# EAGLE design LoRa ST Sensor Node v1.0 (EAGLE 7.5.0)
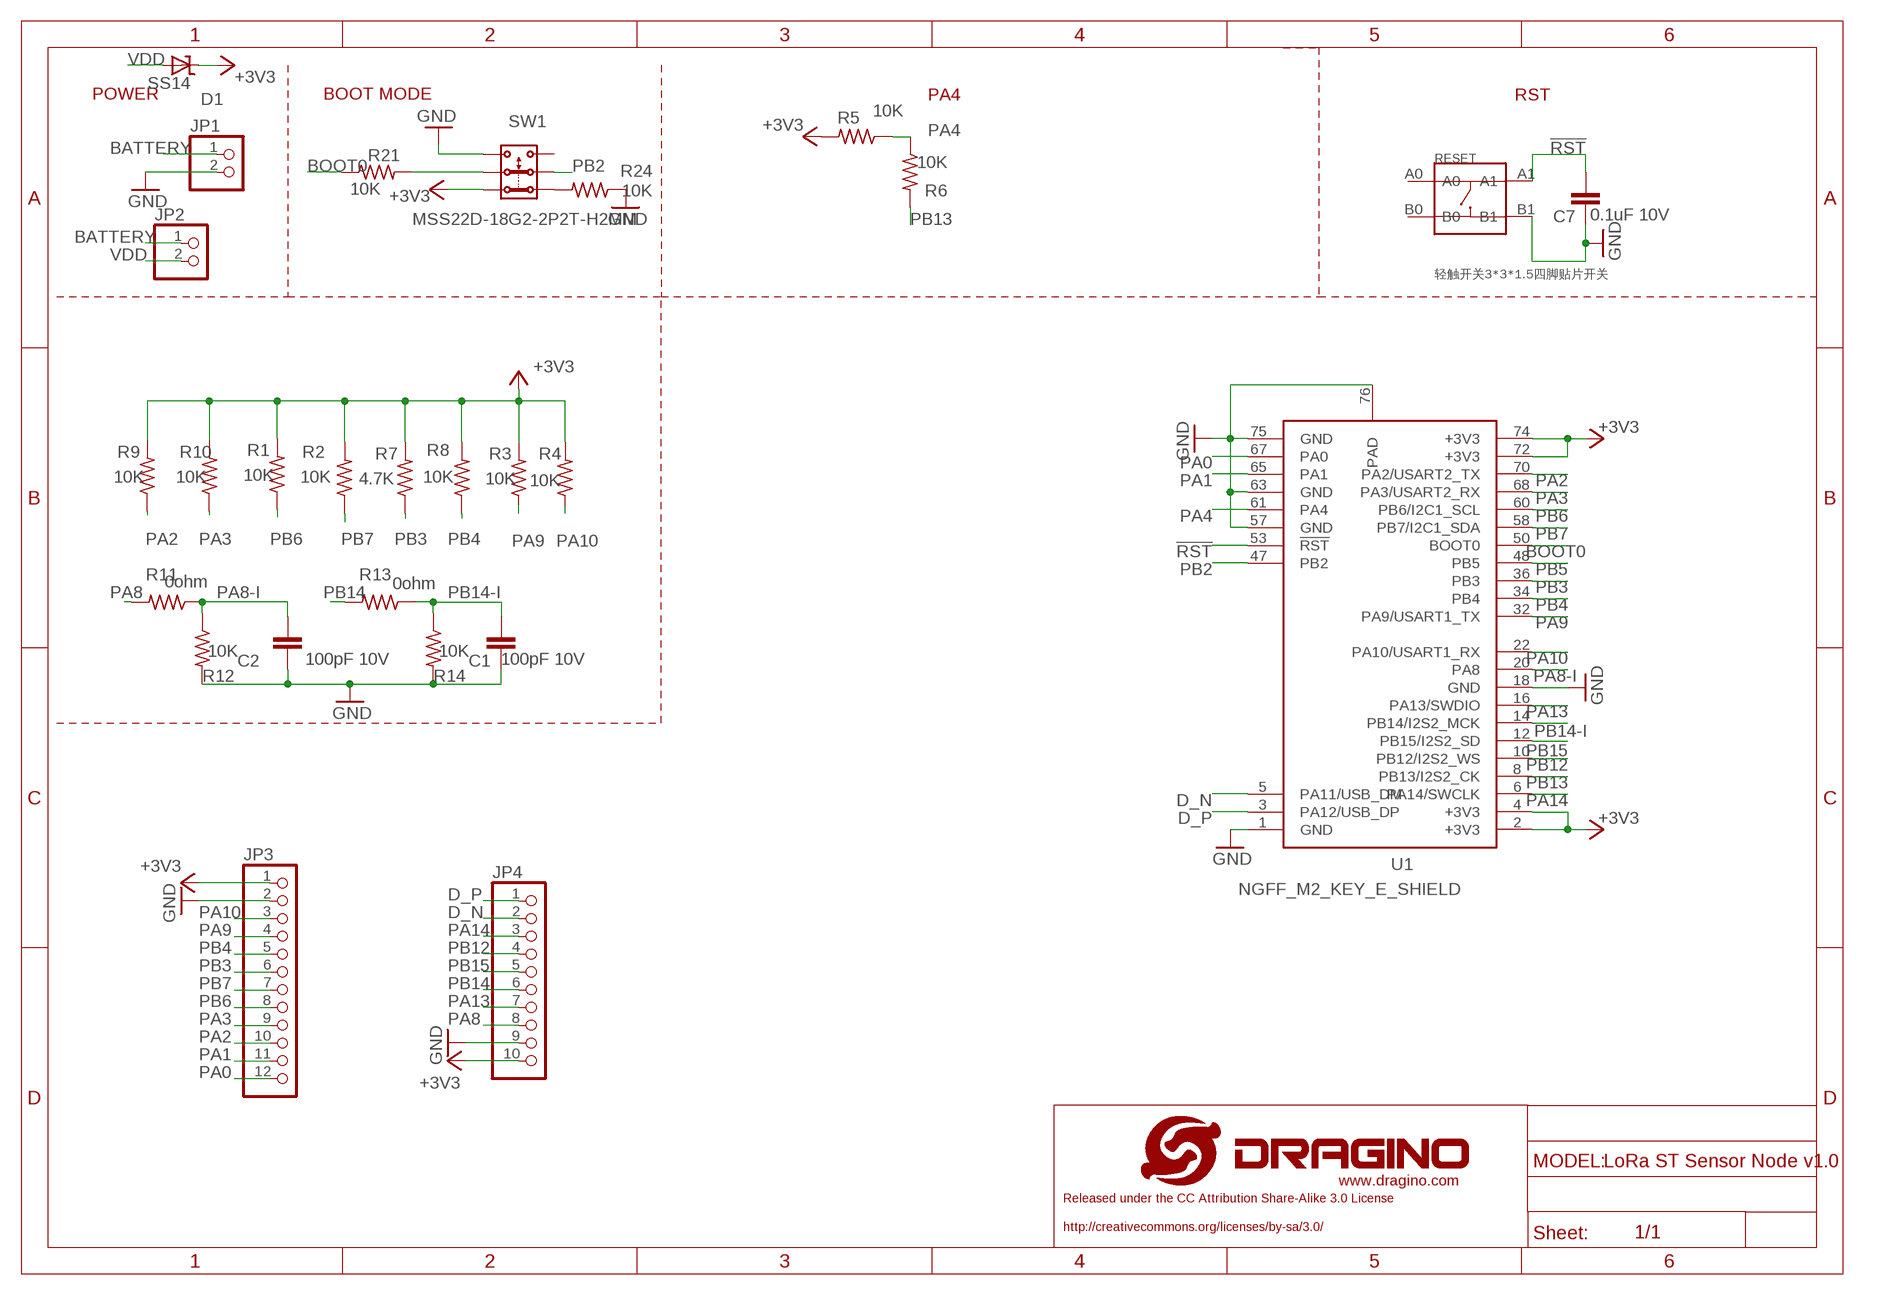
[diagram p0: schematic, sheet 1]

## Parts
C1  100pF 10V  C-EUC0603  [C0603]
C2  100pF 10V  C-EUC0603  [C0603]
C7  0.1uF 10V  C-EUC0402  [C0402]
D1  SS14  SCHOTTKYSMBG  [DO214AC]
JP1  PINHD-1X2POWER  [1X02-SMD]
JP2  PINHD-1X2  [1X02]
JP3  PINHD-1X12""  [1X12-DIP]
JP4  PINHD-1X10""  [1X10-DIP]
R1  10K  R-US_R0402  [R0402]
R2  10K  R-US_R0402  [R0402]
R3  10K  R-US_R0402  [R0402]
R4  10K  R-US_R0402  [R0402]
R5  10K  R-US_R0402  [R0402]
R6  10K  R-US_R0402  [R0402]
R7  4.7K  R-US_R0402  [R0402]
R8  10K  R-US_R0402  [R0402]
R9  10K  R-US_R0402  [R0402]
R10  10K  R-US_R0402  [R0402]
R11  0ohm  R-US_R0603  [R0603]
R12  10K  R-US_R0603  [R0603]
R13  0ohm  R-US_R0603  [R0603]
R14  10K  R-US_R0603  [R0603]
R21  10K  R-US_R0402  [R0402]
R24  10K  R-US_R0402  [R0402]
RESET  轻触开关3*3*1.5四脚贴片开关  BUTTON-4P-3.3X3.3  [SW4-SMD-3.35X3.35X1.5MM]
SW1  MSS22D-18G2-2P2T-H2MM  [MSS22D-18G2-2P2T-H2MM-DIL]
U1  NGFF_M2_KEY_E_SHIELD  [NGFF_M2_KEY_E_SHIELD]

## Nets
!RST: C7.2 RESET.A1 U1.53(!RST)
+3V3: D1.C JP3.1 JP4.10 R1.2 R2.2 R3.2 R4.2 R5.2 R7.2 R8.2 R9.2 R10.2 SW1.3 U1.2(+3V3) U1.4(+3V3) U1.72(+3V3) U1.74(+3V3)
BATTERY: JP1.1 JP2.1
BOOT0: R21.1 U1.50(BOOT0)
D_N: JP4.2 U1.5(PA11/USB_DM)
D_P: JP4.1 U1.3(PA12/USB_DP)
GND: C1.1 C2.1 C7.1 JP1.2 JP3.2 JP4.9 R12.2 R14.2 R24.1 RESET.B1 SW1.1 U1.1(GND) U1.18(GND) U1.57(GND) U1.63(GND) U1.75(GND) U1.76(PAD)
N$4: R24.2 SW1.4
N$22: R21.2 SW1.2
PA0: JP3.12 U1.67(PA0)
PA1: JP3.11 U1.65(PA1)
PA2: JP3.10 R9.1 U1.70(PA2/USART2_TX)
PA3: JP3.9 R10.1 U1.68(PA3/USART2_RX)
PA4: R5.1 R6.1 U1.61(PA4)
PA8: JP4.8 R11.2
PA8-I: C2.2 R11.1 R12.1 U1.20(PA8)
PA9: JP3.4 R3.1 U1.32(PA9/USART1_TX)
PA10: JP3.3 R4.1 U1.22(PA10/USART1_RX)
PA13: JP4.7 U1.16(PA13/SWDIO)
PA14: JP4.3 U1.6(PA14/SWCLK)
PB2: SW1.5 U1.47(PB2)
PB3: JP3.6 R7.1 U1.36(PB3)
PB4: JP3.5 R8.1 U1.34(PB4)
PB5: U1.48(PB5)
PB6: JP3.8 R1.1 U1.60(PB6/I2C1_SCL)
PB7: JP3.7 R2.1 U1.58(PB7/I2C1_SDA)
PB12: JP4.4 U1.10(PB12/I2S2_WS)
PB13: R6.2 U1.8(PB13/I2S2_CK)
PB14: JP4.6 R13.2
PB14-I: C1.2 R13.1 R14.1 U1.14(PB14/I2S2_MCK)
PB15: JP4.5 U1.12(PB15/I2S2_SD)
VDD: D1.A JP2.2
Unconnected: RESET.A0 RESET.B0 SW1.6

## Notes on the sheet
- PA4 | RST
- POWER | BOOT MODE

## Library data of the parts
C1 C2 C7 = dragino:C-EU: CAPACITOR, European symbol
D1 = dragino:SCHOTTKY: Suppressor diode; OC_FARNELL: unknown
JP1 JP2 = pinhead:PINHD-1X2: PIN HEADER
JP3 = pinhead:PINHD-1X12: PIN HEADER
JP4 = pinhead:PINHD-1X10: PIN HEADER
R1-R14 R21 R24 = dragino:R-US_: RESISTOR, American symbol
RESET = dragino:BUTTON-4P: SW4-6.0X6.0X5.0MM:311020024;SW4-8.0X8.0X9.0MM:311020028;SW4-SMD-6.0X6.0X5.0MM:311020004;SW4-SMD-3.35X3.35X1.5MM:311020030;SW4-SMD-5.2X5.2X2.5MM:311020046
SW1 = dragino:MSS22D-18G2-2P2T-H2MM
U1 = dragino:NGFF_M2_KEY_E_SHIELD

## Net classes
0 default: width 0.203 mm, clearance 0.203 mm
1 vcc: width 0.254 mm

## Board
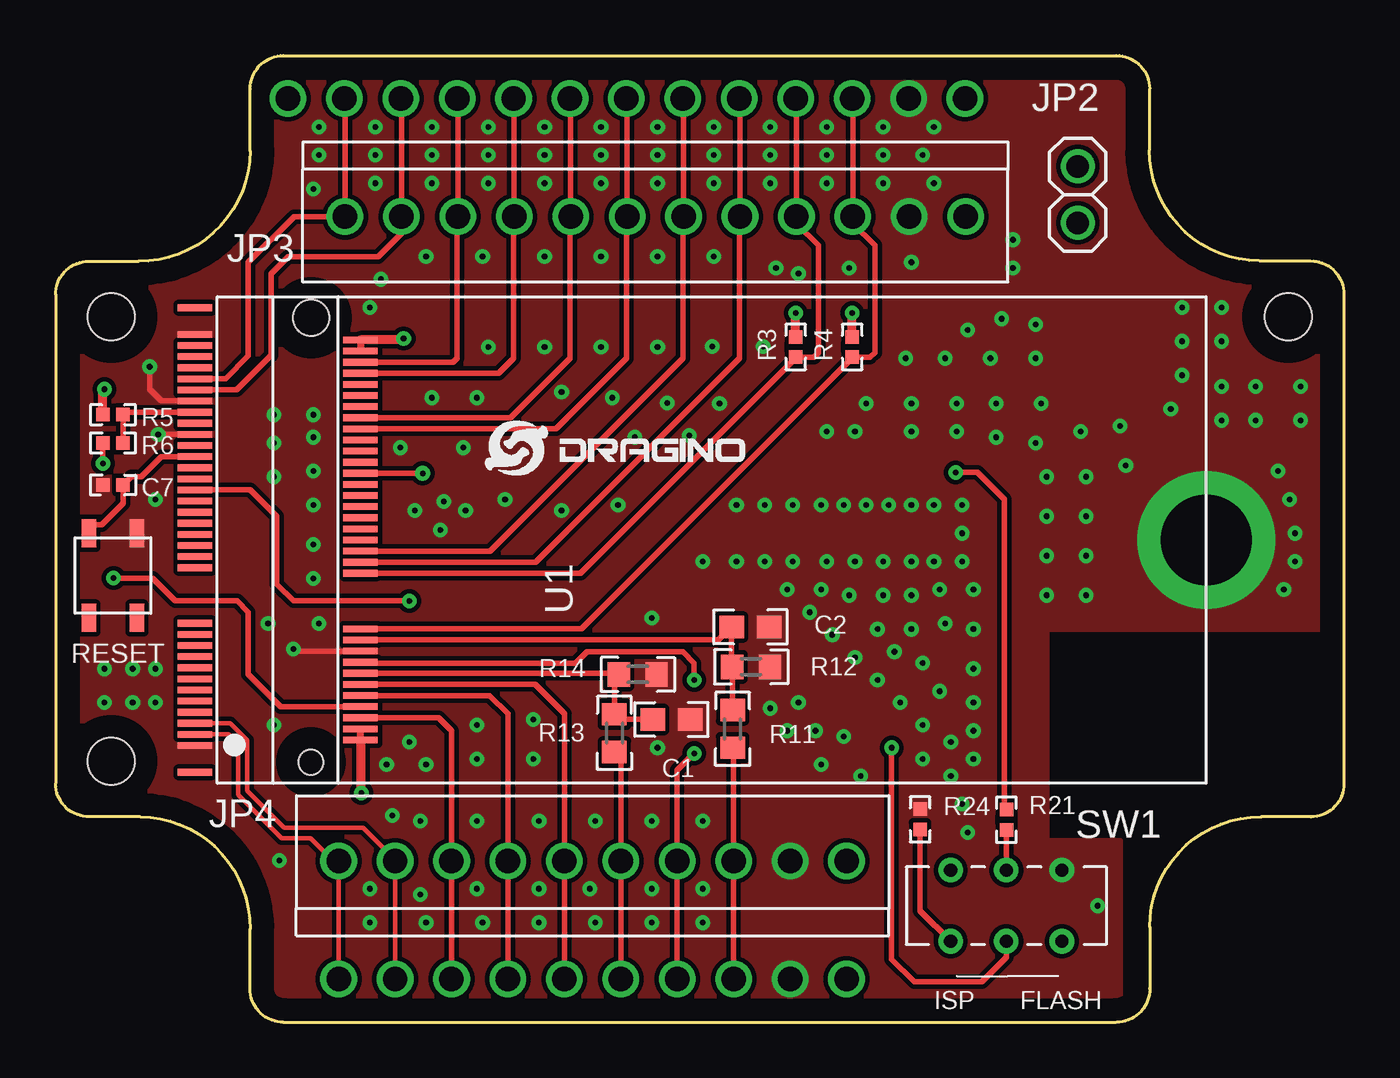
[diagram p1: board, top side]
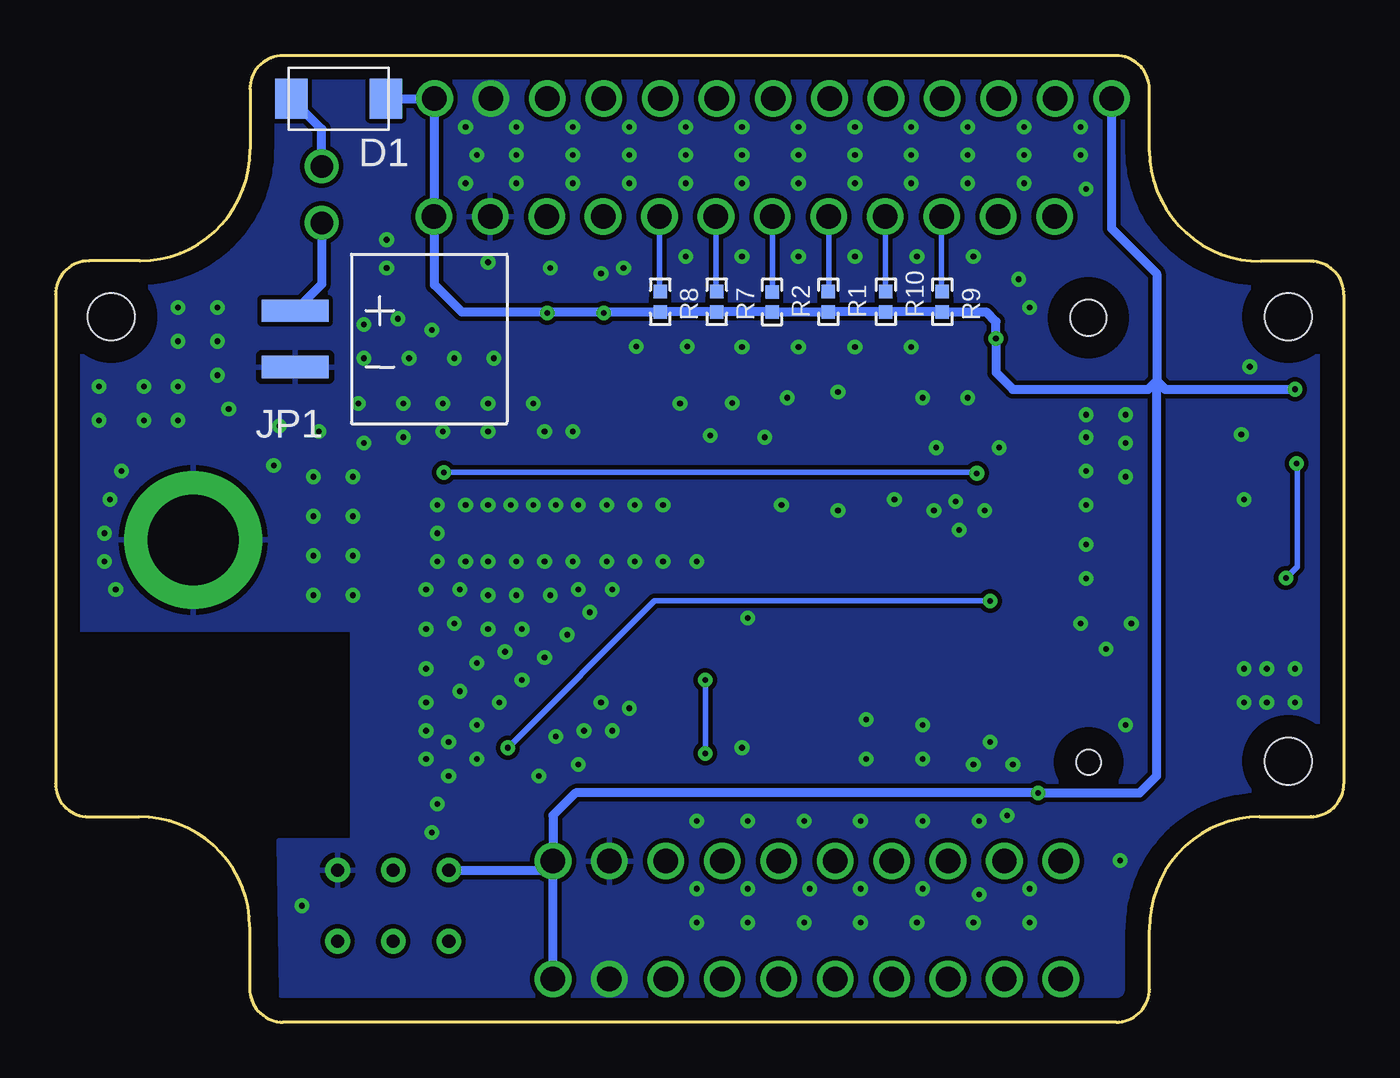
[diagram p2: board, bottom side, seen from below]

Size 58 x 43.5 mm. Coordinates in mm from the lower left corner, seen from the top.
Copper layers (1*16): Top 0.035mm / dielectric 1.5mm / Bottom 0.035mm
Design rules "default *": minimum track width 6mil, minimum drill 10mil, track to track 6mil, track to pad 10mil, pad to pad 6mil, via to via 6mil, smd to smd 6mil, copper to edge 40mil, drill to drill 8mil, minimum pad ring 10mil, minimum via ring 8mil, stop-mask expansion 4mil, vias tented up to drill 30mil, thermal gap 10mil
Holes 2.1 mm at 55.5,31.75 2.5,31.75 2.5,11.75

### Footprints (pad centres in the part's own frame; a part is rotated, then mirrored left to right if it is on the bottom)
C0603 = smd 1.1 x 1: 1 -0.85,0; 2 0.85,0
C0402 = smd 0.61 x 0.61: 1 -0.457,0; 2 0.457,0
DO214AC = smd 1.45 x 1.8: A 2.13,0; C -2.13,0
1X02-SMD = smd 3 x 1: 1 0,1.27; 2 0,-1.27
1X02 = drill 1.016: 1 -1.27,0; 2 1.27,0
1X12-DIP = drill 1.1: 1 -13.97,0; 2 -11.43,0; 3 -8.89,0; 4 -6.35,0; 5 -3.81,0; 6 -1.27,0; 7 1.27,0; 8 3.81,0; 9 6.35,0; 10 8.89,0; 11 11.43,0; 12 13.97,0
1X10-DIP = drill 1.1: 1 -11.43,0; 2 -8.89,0; 3 -6.35,0; 4 -3.81,0; 5 -1.27,0; 6 1.27,0; 7 3.81,0; 8 6.35,0; 9 8.89,0; 10 11.43,0
R0402 = smd 0.61 x 0.61: 1 -0.457,0; 2 0.457,0
R0603 = smd 1 x 1.1: 1 -0.85,0; 2 0.85,0
SW4-SMD-3.35X3.35X1.5MM = smd 1.27 x 0.635: A0 -1.905,1.079; A1 1.905,1.079; B0 -1.905,-1.079; B1 1.905,-1.079
MSS22D-18G2-2P2T-H2MM-DIL = drill 0.6: 1 -2.5,-1.6; 2 0,-1.6; 3 2.5,-1.6; 4 2.5,1.6; 5 0,1.6; 6 -2.5,1.6
NGFF_M2_KEY_E_SHIELD = smd 0.3 x 1.55: 1 1.7,-0.775; 2 1.95,-8.225; 3 2.2,-0.775; 4 2.45,-8.225; 5 2.7,-0.775; 6 2.95,-8.225; 7 3.2,-0.775; 8 3.45,-8.225; 9 3.7,-0.775; 10 3.95,-8.225; 11 4.2,-0.775; 12 4.45,-8.225; 13 4.7,-0.775; 14 4.95,-8.225; 15 5.2,-0.775; 16 5.45,-8.225; 17 5.7,-0.775; 18 5.95,-8.225; 19 6.2,-0.775; 20 6.45,-8.225; 21 6.7,-0.775; 22 6.95,-8.225; 23 7.2,-0.775; 32 9.45,-8.225; 33 9.7,-0.775; 34 9.95,-8.225; 35 10.2,-0.775; 36 10.45,-8.225; 37 10.7,-0.775; 38 10.95,-8.225; 39 11.2,-0.775; 40 11.45,-8.225; 41 11.7,-0.775; 42 11.95,-8.225; 43 12.2,-0.775; 44 12.45,-8.225; 45 12.7,-0.775; 46 12.95,-8.225; 47 13.2,-0.775; 48 13.45,-8.225; 49 13.7,-0.775; 50 13.95,-8.225; 51 14.2,-0.775; 52 14.45,-8.225; 53 14.7,-0.775; 54 14.95,-8.225; 55 15.2,-0.775; 56 15.45,-8.225; 57 15.7,-0.775; 58 15.95,-8.225; 59 16.2,-0.775; 60 16.45,-8.225; 61 16.7,-0.775; 62 16.95,-8.225; 63 17.2,-0.775; 64 17.45,-8.225; 65 17.7,-0.775; 66 17.95,-8.225; 67 18.2,-0.775; 68 18.45,-8.225; 69 18.7,-0.775; 70 18.95,-8.225; 71 19.2,-0.775; 72 19.45,-8.225; 73 19.7,-0.775; 74 19.95,-8.225; 75 20.2,-0.775; X 0.5,-0.775; Y 21.4,-0.775 | drill 4.09 pad 6.2: 76 10.95,-46.3 | hole 1.6: 20.95,-6 | hole 1.1: 0.95,-6

### Placement (x,y rotation side)
C1  27.73,13.62 180 top
C2  31.29,17.79 180 top
C7  2.59,24.17 0 top
D1  45.26,41.56 180 bottom
JP1  47.22,30.75 0 bottom
JP2  46.02,37.24 90 top
JP3  27,36.25 180 top
JP4  24.18,7.25 0 top
R1  23.21,32.42 270 bottom
R2  25.75,32.41 270 bottom
R3  33.32,30.39 90 top
R4  35.86,30.39 90 top
R5  2.59,27.34 180 top
R6  2.59,26.07 180 top
R7  28.24,32.42 270 bottom
R8  30.78,32.42 270 bottom
R9  18.08,32.42 270 bottom
R10  20.62,32.42 270 bottom
R11  30.48,13.2 270 top
R12  31.31,15.99 0 top
R13  25.16,13.01 270 top
R14  26.21,15.65 0 top
R21  42.81,9.11 270 top
R24  38.92,9.13 270 top
RESET  2.59,20.1 90 top
SW1  42.8,5.24 180 top
U1  5.5,10.75 90 top
U$1  [LORA_ST_SENSOR_NODE]  29,21.75 0 top
U$2  LOGO-NEW  [LOGO-SILK-NEW]  19.33,24.61 0 top

### Tracks (layer width: path | path; a pad name or v marks a point on that pad's centre or on a via)
!RST
  Top 0.254: RESET.A1 1.51,22.45 1.57,22.39 2.08,22.39 3.04,23.35 C7.2 3.41,24.54 3.86,24.54 4.76,25.45 U1.53
+3V3  (via drill 0.25, 1.1)
  Top 0.305: U1.2 U1.4 | U1.74 U1.72
  Top 0.406: v15.67,30.77 15.6,30.7 U1.74 | R5.2 2.13,28.41 arc-90 v2.21,28.48 | v13.76,10.32 13.76,12.66 U1.2 | R3.2 v33.32,31.91 | R4.2 v35.86,31.91
  Bottom 0.406: 8.43,28.86 8.43,11.08 9.19,10.32 v13.76,10.32 34.59,10.32 35.61,9.3 JP4.10 | 8.43,28.86 8.05,28.48 v2.21,28.48 | 8.43,28.86 8.81,28.48 14.91,28.48 15.67,29.24 v15.67,30.77 15.67,31.53 16.1,31.96 R9.2 R10.2 R1.2 R2.2 25.75,31.96 R7.2 R8.2 33.32,31.96 | SW1.3 36.02,6.84 JP4.10 | v35.61,1.94 JP4.10 | v10.46,41.56 10.46,35.72 8.43,33.69 8.43,28.86 | 35.81,31.96 39.72,31.96 40.94,33.18 40.94,36.22 JP3.1 40.94,36.28 v40.94,41.56 D1.C | v35.86,31.91 35.81,31.96 | 35.81,31.96 33.32,31.96 | v33.32,31.91 33.32,31.96
BATTERY
  Bottom 0.406: JP2.1 46.02,33.22 JP1.1
BOOT0  (via drill 0.25)
  Top 0.254: U1.50 16.2,24.7 v16.53,24.7 | R21.1 42.72,9.66 42.72,23.53 41.51,24.74 v40.52,24.74
  Bottom 0.254: v16.53,24.7 16.57,24.74 v40.52,24.74
D_N  (via drill 1.1)
  Top 0.203: U1.5 7.87,13.45 8.63,12.69 8.63,10.4 10.29,8.74 13.85,8.74 15.29,7.3 JP4.2 v15.29,1.94
D_P  (via drill 1.1)
  Top 0.203: U1.3 7.8,12.95 8.23,12.52 8.23,10.24 10.17,8.29 11.48,8.29 12.52,7.25 JP4.1 v12.75,1.94
GND  (via drill 0.25, 1.1)
  Top 0.254: U1.18 10.81,16.7 v10.71,16.8 | U1.57 v4.62,26.45 | v4.24,29.5 4.24,28.48 4.75,27.97 6.25,27.97 U1.63
  other vias: 2.21,15.91 3.48,15.91 4.49,15.91 3.48,14.38 4.49,14.38 46.91,5.24 11.6,19.97 34.72,26.58 35.99,26.58 42.34,26.32 46.15,26.58 47.93,26.83 54.02,28.61 2.21,14.38 10.08,7.27 38.4,41.56 33.07,1.94 55.04,24.8 55.55,23.53 55.8,22 55.8,20.73 55.29,19.46 56.05,28.61 56.05,27.08 54.02,27.08 52.5,27.08 52.5,28.61 44.62,22.77 46.4,22.77 44.62,20.99 46.4,20.99 44.62,19.21 46.4,19.21 44.62,24.54 46.4,24.54 30.65,23.27 31.92,23.27 33.19,23.27 34.46,23.27 35.48,23.27 36.5,23.27 37.51,23.27 38.53,23.27 39.54,23.27 40.81,23.27 40.81,22 40.81,20.73 39.54,20.73 38.53,20.73 37.26,20.73 35.99,20.73 34.72,20.73 33.19,20.73 31.92,20.73 30.65,20.73 29.13,20.73 32.94,19.46 33.96,18.45 34.97,17.43 35.99,16.42 37,15.4 38.02,14.38 39.04,13.37 39.04,11.84 41.32,11.84 40.31,11.08 40.81,9.81 41.07,8.54 40.31,12.61 41.32,13.11 41.32,14.38 41.32,15.91 41.32,17.69 41.32,19.46 39.8,19.46 38.53,19.21 37.26,19.21 35.73,19.21 34.46,19.46 37,17.69 38.53,17.69 40.05,17.94 39.04,16.16 37.77,16.67 39.8,14.89 32.94,13.11 34.21,13.11 35.48,12.86 34.46,11.59 36.24,11.08 40.56,26.58 38.53,26.58 36.5,27.85 38.53,27.85 40.56,27.85 42.34,27.85 44.37,27.85 44.12,26.07 50.21,27.59 11.6,21.5 11.6,23.27 11.6,24.8 11.6,26.32 11.6,27.34 9.83,27.34 9.83,26.07 9.83,24.54 9.83,13.37 9.57,17.94 11.86,17.94 50.72,32.16 52.5,32.16 50.72,30.64 52.5,30.64 50.72,29.12 48.18,25.05 4.49,23.53 26.84,9.05 26.84,4.48 26.84,6 14.14,6 14.14,4.48 19.22,4.48 18.97,6 18.97,13.37 18.97,11.84 18.97,9.05 21.51,13.62 21.51,11.84 21.76,9.05 24.3,9.05 24.05,6 24.3,4.48 21.76,6 21.76,4.48 29.13,9.05 29.13,4.48 29.13,6 16.18,23.02 18.46,23.02 25.07,28.1 27.1,30.39 24.56,30.39 22.02,30.39 19.48,30.39 16.94,28.1 18.97,28.1 22.78,28.35 27.54,27.86 22.78,23.02 20.24,23.53 29.89,27.85 25.32,23.27 32.43,33.94 33.45,33.69 32.18,39.02 32.18,40.29 29.64,40.29 29.64,39.02 27.1,40.29 27.1,39.02 24.56,39.02 24.56,40.29 22.02,40.29 22.02,39.02 19.48,39.02 19.48,40.29 16.94,40.29 16.94,39.02 14.4,40.29 14.4,39.02 14.65,33.43 16.68,34.45 14.14,32.16 26.08,26.32 29.57,30.4 31.86,30.4 28.53,26.4 18.36,25.85 15.52,25.85 17.33,22.15 17.48,23.44 38.27,29.88 40.05,29.88 42.08,29.88 44.12,29.88 44.12,31.4 42.59,31.66 41.07,31.15 43.1,33.94 43.1,35.21 19.22,34.45 22.02,34.45 24.56,34.45 27.1,34.45 29.64,34.45 35.73,33.94 38.53,34.2 39.04,39.02 34.72,40.29 39.54,40.29 34.72,39.02 39.54,37.75 16.43,9.05 15.16,9.3 16.68,4.48 16.43,5.75 11.86,39.02 11.86,40.29 11.6,37.5 14.4,37.75 16.94,37.75 19.48,37.75 22.02,37.75 24.56,37.75 27.1,37.75 29.64,37.75 32.18,37.75 34.72,37.75 37.26,37.75 37.26,39.02 37.26,40.29 15.92,12.61 14.91,11.59 16.68,11.59 33.45,14.38 26.84,18.19 27.1,12.35 32.18,14.13
  pour Top (no thermals): 0.05,32.67 0.05,10.66 arc90 1.47,9.24 3.79,9.24 arc-90 8.81,4.22 8.81,1.43 arc90 10.21,0.03 47.93,0.03 47.93,8.16 44.62,8.16 44.62,17.69 57.96,17.69 57.96,32.66 arc90 56.35,34.27 54.17,34.27 arc-90 49.25,39.19 49.25,42.01 arc90 47.8,43.47 10.24,43.47 arc90 8.77,41.99 8.77,39.33 arc-90 3.67,34.23 1.61,34.23 arc90
  pour Bottom: 0.05,32.67 0.05,10.75 arc90 1.58,9.21 3.94,9.21 arc-90 8.73,4.42 8.73,1.6 arc90 10.34,-0.01 47.8,-0.01 47.93,8.16 44.62,8.16 44.62,17.69 57.96,17.69 57.96,32.85 arc90 56.57,34.25 54.16,34.25 arc-90 49.23,39.17 49.23,42.04 arc90 47.8,43.47 10.31,43.47 arc90 8.76,41.91 8.76,39.48 arc-90 3.6,34.32 1.7,34.32 arc90
N$4
  Top 0.254: SW1.4 38.92,5.02 R24.2
N$22
  Top 0.254: SW1.2 R21.2
PA0  (via drill 1.1)
  Top 0.254: U1.67 6.29,28.96 7.65,28.96 8.68,29.99 8.68,34.2 10.74,36.25 JP3.12 13.03,41.53 v13,41.56
PA1  (via drill 1.1)
  Top 0.254: U1.65 8.14,28.45 9.7,30.01 9.7,33.69 10.46,34.45 14.53,34.45 15.57,35.5 JP3.11 15.57,41.53 v15.54,41.56
PA2  (via drill 1.1)
  Top 0.254: 18.11,35.94 JP3.10 | v18.08,41.56 18.11,41.53 JP3.10 | U1.70 17.9,29.7 18.08,29.88 18.08,36.22 JP3.10
  Bottom 0.254: R9.1 18.11,32.91 JP3.10
PA3  (via drill 1.1)
  Top 0.254: 20.65,35.94 JP3.9 | v20.62,41.56 20.65,41.53 JP3.9 | U1.68 19.94,29.2 20.62,29.88 20.62,36.22 JP3.9
  Bottom 0.254: R10.1 20.65,32.91 JP3.9
PA4
  Top 0.254: 6.29,27.46 U1.61 3.16,27.45 arc90 R5.1 R6.1
PA8  (via drill 1.1)
  Top 0.254: v30.53,1.94 JP4.8 30.53,12.3 R11.2
PA8-I
  Top 0.254: R11.1 30.48,15.97 R12.1 30.44,16.01 C2.2 29.85,17.2 U1.20
PA9  (via drill 1.1)
  Top 0.254: JP3.4 33.35,35.94 34.34,34.96 34.34,30.13 34.13,29.93 R3.1 33.32,29.88 23.64,20.2 U1.32 | v33.32,41.56 33.35,41.53 JP3.4 | 33.32,36.22 JP3.4
PA10  (via drill 1.1)
  Top 0.254: JP3.3 35.89,35.94 36.88,34.96 36.88,30.13 36.67,29.93 R4.1 35.86,29.88 23.68,17.7 U1.22 | v35.86,41.56 35.89,41.53 JP3.3 | 35.86,36.22 JP3.3
PA13  (via drill 0.25, 1.1)
  Top 0.254: v27.99,1.94 JP4.7 27.99,11.34 v28.75,12.1 | U1.16 13.77,16.16 23.41,16.16 23.92,16.67 28.24,16.67 28.75,16.16 v28.75,15.4
  Bottom 0.254: v28.75,12.1 v28.75,15.4
PA14  (via drill 1.1)
  Top 0.254: U1.6 17.24,13.7 17.83,13.11 JP4.3 v17.83,1.94
PB2  (via drill 0.25)
  Top 0.254: v37.64,12.35 37.64,2.83 38.66,1.81 41.7,1.81 42.8,2.91 SW1.5 | U1.47 8.77,23.95 9.95,22.77 9.95,19.72 10.71,18.96 v15.92,18.96
  Bottom 0.254: v15.92,18.96 31.04,18.96 v37.64,12.35
PB3  (via drill 1.1)
  Top 0.254: 28.27,35.94 JP3.6 | v28.24,41.56 28.27,41.53 JP3.6 | U1.36 19.56,21.2 28.24,29.88 28.24,36.22 JP3.6
  Bottom 0.254: R7.1 28.27,32.91 JP3.6
PB4  (via drill 1.1)
  Top 0.254: 30.81,35.94 JP3.5 | v30.78,41.56 30.81,41.53 JP3.5 | U1.34 21.6,20.7 30.78,29.88 30.78,36.22 JP3.5
  Bottom 0.254: R8.1 30.81,32.91 JP3.5
PB6  (via drill 1.1)
  Top 0.254: 23.19,35.94 JP3.8 | v23.16,41.56 23.19,41.53 JP3.8 | U1.60 20.48,27.2 23.16,29.88 23.16,36.22 JP3.8
  Bottom 0.254: R1.1 23.19,32.89 JP3.8
PB7  (via drill 1.1)
  Top 0.254: 25.73,35.94 JP3.7 | v25.7,41.56 25.73,41.53 JP3.7 | U1.58 22.52,26.7 25.7,29.88 25.7,36.22 JP3.7
  Bottom 0.254: R2.1 JP3.7
PB12  (via drill 1.1)
  Top 0.254: U1.10 19.54,14.7 20.37,13.88 JP4.4 v20.37,1.94
PB13  (via drill 0.25)
  Top 0.254: U1.8 10.14,14.2 8.68,15.65 8.68,18.45 8.18,18.96 5.38,18.96 4.36,19.97 2.63,19.97 v2.61,19.99 | R6.2 v2.13,25.14
  Bottom 0.254: v2.13,25.14 2.11,25.11 2.11,20.5 v2.61,19.99
PB14  (via drill 1.1)
  Top 0.254: v25.45,1.94 JP4.6 25.45,11.88 R13.2
PB14-I
  Top 0.254: U1.14 25.2,15.7 | 25.2,15.7 25.19,15.7 | R13.1 25.36,13.86 | R13.1 25.16,15.46 R14.1 25.31,15.7 25.2,15.7 | C1.2 25.4,13.62 R13.1
PB15  (via drill 1.1)
  Top 0.254: U1.12 21.58,15.2 22.91,13.88 JP4.5 v22.91,1.94
VDD
  Bottom 0.406: JP2.2 46.02,40.19 D1.A

### Text on the board
tPlace: ISP | FLASH
tDocu: LoRa Sensor Node v1.0